# Altium schematic sheet BME590LEDV1Schematic.SchDoc
size A
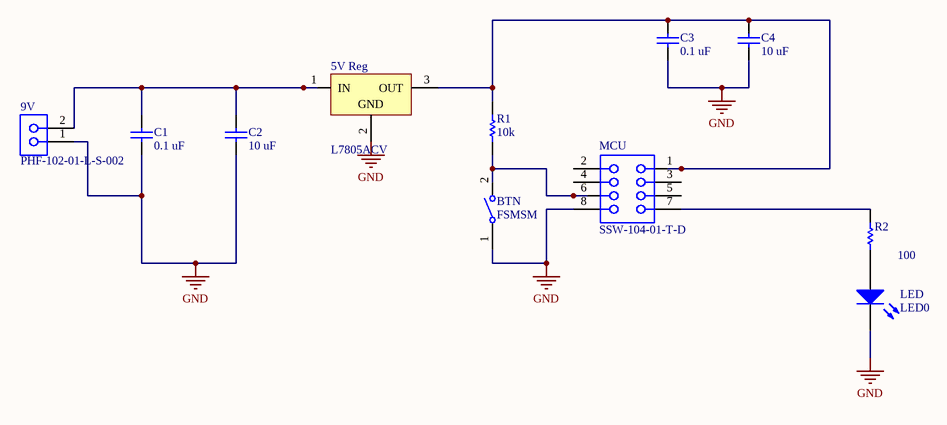
[diagram p0: BME590LEDV1Schematic.SchDoc]

## Parts
5V_Reg  L7805ACV  [TO220]
9V  PHF-102-01-L-S-002  [SMTC-PHF-102-01-X-S-002]
BTN  FSMSM  [TECO-FSMSM-2_V]
C1  0.1 uF  [CAPC2013X70X45NL10T25]
C2  10 uF  [CAPC2013X70X45NL10T25]
C3  0.1 uF  [CAPC2013X70X45NL10T25]
C4  10 uF  [CAPC2013X70X45NL10T25]
LED  LED0  [LED-0]
MCU  SSW-104-01-T-D  [SMTC-SSW-104-01-X-D]
R1  10k  [RESC2013X60X35LL10T20]
R2  100  [RESC2013X60X35LL10T20]

## Nets
GND: 5V_Reg.2(GND) 9V.1 BTN.1 C1.1 C2.1 C3.1 C4.1 LED.2(K) MCU.8
Net5V_Reg_1: 5V_Reg.1(IN) 9V.2 C1.2 C2.2
Net5V_Reg_3: 5V_Reg.3(OUT) C3.2 C4.2 MCU.1 R1.2
NetBTN_2: BTN.2 MCU.6 R1.1
NetLED_1: LED.1(A) R2.1
NetMCU_7: MCU.7 R2.2

Not connected (* = marked no-connect by the designer): MCU 2 3 4 5

## Library data of the parts
5V_Reg = CMP-0244-00484-1: Positive Voltage Regulator, 5V, 3-Pin TO-220; DatasheetVersion: 16/11/2011; ComponentLink2Description: Datasheet; ComponentLink3Description: Package Specification; ComponentLink2URL: http://www.st.com/internet/com/TECHNICAL_RESOURCES/TECHNICAL_LITERATURE/DATASHEET/CD00000444.pdf; PackageDescription: TO, Thru-Hole, Vertical, Heatsink Mounted; 3 In-Line Leads; Pitch 2.54 mm; ComponentLink3URL: http://www.st.com/internet/com/TECHNICAL_RESOURCES/TECHNICAL_LITERATURE/PACKAGE_INFORMATION/CD00004649.pdf; PackageReference: TO220; ComponentLink1URL: http://www.st.com; PackageVersion: ver3.0; ComponentLink1Description: Manufacturer URL
9V = CMP-1023-00103-1: Press Fit Socket, Through-hole, Vertical, -55 to 125 degC, 2.54 mm Pitch, 2-Pin, Female, RoHS; Manufacturer: Samtec; Pitch: 2.54 mm; Temperature Range: -55 to 125 degC; PackageDescription: .100 Press Fit Socket Assembly; ComponentLink1URL: http://www.samtec.com; ComponentLink1Description: Manufacturer URL; PackageReference: PHF-102-01-X-S-002; Orientation: Vertical; ComponentLink2URL: http://www.samtec.com/documents/webfiles/pdf/phf.pdf; ComponentLink3Description: Package Specification; RoHS: True; DatasheetVersion: F-214; PartNumber: PHF-102-01-L-S-002; ComponentLink2Description: Datasheet; PackageVersion: F, 9/2009; ComponentLink3URL: http://www.samtec.com/documents/webfiles/cpdf/PHF-1XX-XX-X-X-XXX-MKT.pdf; Mounting Technology: Through-hole
BTN = CMP-2000-07511-1: FSMSM Push Button Switch, 50 mA, -35 to 85 degC, 2-Pin SMD, RoHS, Bulk; Manufacturer: TE Connectivity; Actuator Length: 1.07mm; Electrical Life: 20000Cycles; Actuator Material: Polyamide; Current Rating: 50mA; Illumination Type: Illuminated; Voltage Rating (DC): 24V; Contact Resistance: 100mOhm; Case\/Package: SMD/SMT; Operating Force: 180gf; Switch Travel: 0.25mm; Max Voltage Rating (DC): 12V; Throw Configuration: SPST; Packaging: LoosePiece; Max Operating Temperature: 85degC; ELV: Compliant; Package Description: 2-Pin Surface Mount Device, Body 6 x 3.5 mm, Pitch 9.19 mm; RoHSCompliant: true; Manufacturer URL: http://www.te.com/; Contact Plating: Silver; Contact Material: Brass; Mounting Technology: SurfaceMount; Contact Current Rating: 50mA; Datasheet Version: Rev. C2, 08/2014; Datasheet URL: http://www.te.com/commerce/DocumentDelivery/DDEController?Action=showdoc&DocId=Customer+Drawing%7F1437566-3%7FC2%7Fpdf%7FEnglish%7FENG_CD_1437566-3_C2_1437566_3_1_c.dwg.pdf%7F1437566-3; Mechanical Life: 20000Cycles; Package Reference: FSMSM; REACH SVHC: Unknown; Orientation: Straight; Min Operating Temperature: -35degC; Lead Free: LeadFree; Termination: GullWing; Package Quantity: 1000; Mount: SurfaceMount
C1-C4 = CMP-2000-05013-1: Chip Capacitor, 10 nF, +/- 10%, 50 V, -55 to 125 degC, 0805 (2012 Metric), RoHS, Tape and Reel; Manufacturer: Murata; Voltage Rating DC: 50V; Capacitance: 0.01uF; Temperature Coefficient / Code: +/-15%; Capacitance - pF: 10000pF; Case Height: 0.6mm; Dielectric: X7R; Case Length: 2mm; Case Width: 1.25mm; Type: GeneralPurposeMLCC; Brand: MurataElectronics; Capacitance - nF: 10nF; Tolerance: 10%; Product Category: MultilayerCeramicCapacitorsMLCC-SMD/SMT; Minimum Operating Temperature: -55C; Voltage Rating: 50V; Series: GRM; Packaging: Reel; Dimensions: 1.25mmWx2mmLx0.6mmH; Operating Temperature Range: -55Cto+125C; Package / Case: 0805(2012metric); Datasheet URL: https://datasheet.ciiva.com/29201/452521-da-01-en-vs-kondensator-0805-29201121.pdf; Maximum Operating Temperature: +125C; Factory Pack Quantity: 4000; Case Code - in: 0805; Case Code - mm: 2012; Manufacturer URL: http://www.murata.com/; Termination Style: SMD/SMT; Datasheet Version: Dec-10; RoHS: Details; Product: GeneralTypeMLCCs
LED = LED0: Typical INFRARED GaAs LED; Published: 8-Jun-2000; LatestRevisionDate: 08-Jul-2005; LatestRevisionNote: Mech Layer 1 removed.; PackageReference: LED-0; Publisher: Altium Limited; PackageDescription: LED; 2 Leads
MCU = CMP-1023-00339-1: SQ Post Socket, Through-hole, Vertical, -55 to 105 degC, 2.54mm Pitch, 8-Pin, Female, RoHS; Manufacturer: Samtec; ComponentLink1Description: Manufacturer URL; ComponentLink3Description: Package Specification; ComponentLink2Description: Datasheet; DatasheetVersion: F-214; PackageDescription: Assembly, Socket Strip .016 X .031 Tail; ComponentLink3URL: http://www.samtec.com/documents/webfiles/cpdf/SSW-1XX-XX-XXX-X-XX-XXX-XX-MKT.pdf; PackageReference: SSW-104-01-X-D; PartNumber: SSW-104-01-T-D; PackageVersion: CA, 6/1987; ComponentLink1URL: http://www.samtec.com; ComponentLink2URL: http://www.samtec.com/documents/webfiles/pdf/SSW_TH.PDF; Temperature Range: -55 to 105 degC; Orientation: Vertical; RoHS: True; Mounting Technology: Through-hole; Pitch: 2.54 mm
R1 R2 = CMP-2001-01501-1: Manufacturer: Yageo; Part Number: RT0805FRE0716KL